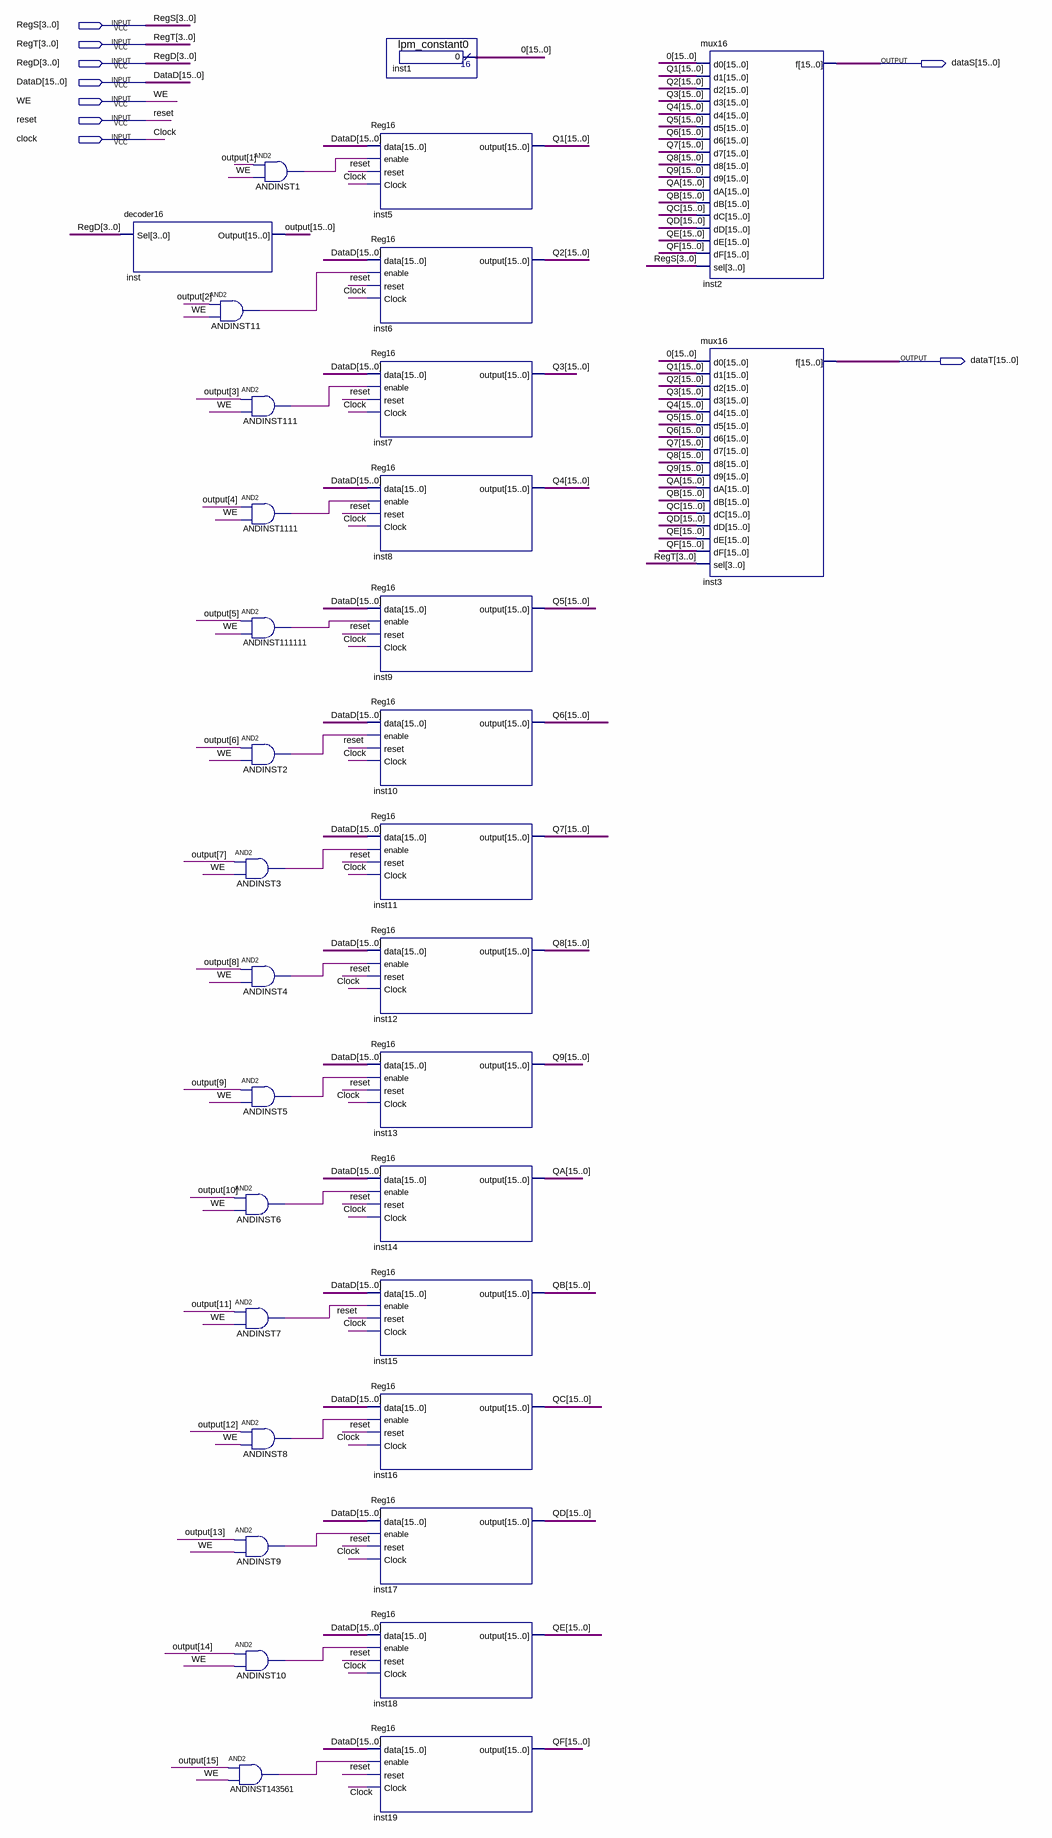
[diagram p0: schematic sheet]
// Quartus schematic SixteenBySixteenRegister.bdf as structural Verilog: 34 symbols, 9 pins
module SixteenBySixteenRegister (
  input  [3:0] RegS,
  input  [3:0] RegT,
  input  [3:0] RegD,
  input  [15:0] DataD,
  input  WE,
  input  reset,
  input  clock,
  output [15:0] dataS,
  output [15:0] dataT
);

  wire ANDINST1_out, ANDINST2_out, ANDINST3_out, ANDINST4_out, ANDINST5_out, ANDINST6_out, ANDINST7_out,
       ANDINST8_out, ANDINST9_out, ANDINST10_out, ANDINST11_out, ANDINST111_out, ANDINST1111_out,
       ANDINST111111_out, ANDINST143561_out;
  wire [15:0] \0 , \output , Q1, Q2, Q3, Q4, Q5, Q6, Q7, Q8, Q9, QA, QB, QC, QD, QE, QF;

  decoder16 inst (.Sel(RegD), .Output(\output ));
  and ANDINST11 (ANDINST11_out, \output [2], WE);
  and ANDINST111 (ANDINST111_out, \output [3], WE);
  and ANDINST1111 (ANDINST1111_out, \output [4], WE);
  and ANDINST111111 (ANDINST111111_out, \output [5], WE);
  and ANDINST2 (ANDINST2_out, \output [6], WE);
  and ANDINST3 (ANDINST3_out, \output [7], WE);
  and ANDINST4 (ANDINST4_out, \output [8], WE);
  and ANDINST5 (ANDINST5_out, \output [9], WE);
  and ANDINST6 (ANDINST6_out, \output [10], WE);
  and ANDINST7 (ANDINST7_out, \output [11], WE);
  and ANDINST8 (ANDINST8_out, \output [12], WE);
  and ANDINST9 (ANDINST9_out, \output [13], WE);
  and ANDINST10 (ANDINST10_out, \output [14], WE);
  and ANDINST143561 (ANDINST143561_out, \output [15], WE);
  and ANDINST1 (ANDINST1_out, \output [1], WE);
  lpm_constant0 inst1 (.result(\0 ));
  Reg16 inst5 (.data(DataD), .enable(ANDINST1_out), .reset(reset), .Clock(clock), .\output (Q1));
  Reg16 inst6 (.data(DataD), .enable(ANDINST11_out), .reset(reset), .Clock(clock), .\output (Q2));
  Reg16 inst7 (.data(DataD), .enable(ANDINST111_out), .reset(reset), .Clock(clock), .\output (Q3));
  Reg16 inst8 (.data(DataD), .enable(ANDINST1111_out), .reset(reset), .Clock(clock), .\output (Q4));
  Reg16 inst9 (.data(DataD), .enable(ANDINST111111_out), .reset(reset), .Clock(clock), .\output (Q5));
  Reg16 inst10 (.data(DataD), .enable(ANDINST2_out), .reset(reset), .Clock(clock), .\output (Q6));
  Reg16 inst11 (.data(DataD), .enable(ANDINST3_out), .reset(reset), .Clock(clock), .\output (Q7));
  Reg16 inst12 (.data(DataD), .enable(ANDINST4_out), .reset(reset), .Clock(clock), .\output (Q8));
  Reg16 inst13 (.data(DataD), .enable(ANDINST5_out), .reset(reset), .Clock(clock), .\output (Q9));
  Reg16 inst14 (.data(DataD), .enable(ANDINST6_out), .reset(reset), .Clock(clock), .\output (QA));
  Reg16 inst15 (.data(DataD), .enable(ANDINST7_out), .reset(reset), .Clock(clock), .\output (QB));
  Reg16 inst16 (.data(DataD), .enable(ANDINST8_out), .reset(reset), .Clock(clock), .\output (QC));
  Reg16 inst17 (.data(DataD), .enable(ANDINST9_out), .reset(reset), .Clock(clock), .\output (QD));
  Reg16 inst18 (.data(DataD), .enable(ANDINST10_out), .reset(reset), .Clock(clock), .\output (QE));
  Reg16 inst19 (.data(DataD), .enable(ANDINST143561_out), .reset(reset), .Clock(clock), .\output (QF));
  mux16 inst2 (
    .d0(\0 ), .d1(Q1), .d2(Q2), .d3(Q3), .d4(Q4), .d5(Q5), .d6(Q6), .d7(Q7), .d8(Q8), .d9(Q9), .dA(QA),
    .dB(QB), .dC(QC), .dD(QD), .dE(QE), .dF(QF), .sel(RegS), .f(dataS));
  mux16 inst3 (
    .d0(\0 ), .d1(Q1), .d2(Q2), .d3(Q3), .d4(Q4), .d5(Q5), .d6(Q6), .d7(Q7), .d8(Q8), .d9(Q9), .dA(QA),
    .dB(QB), .dC(QC), .dD(QD), .dE(QE), .dF(QF), .sel(RegT), .f(dataT));
endmodule
